# EAGLE design breadboarddev2 (EAGLE 8.4.3)
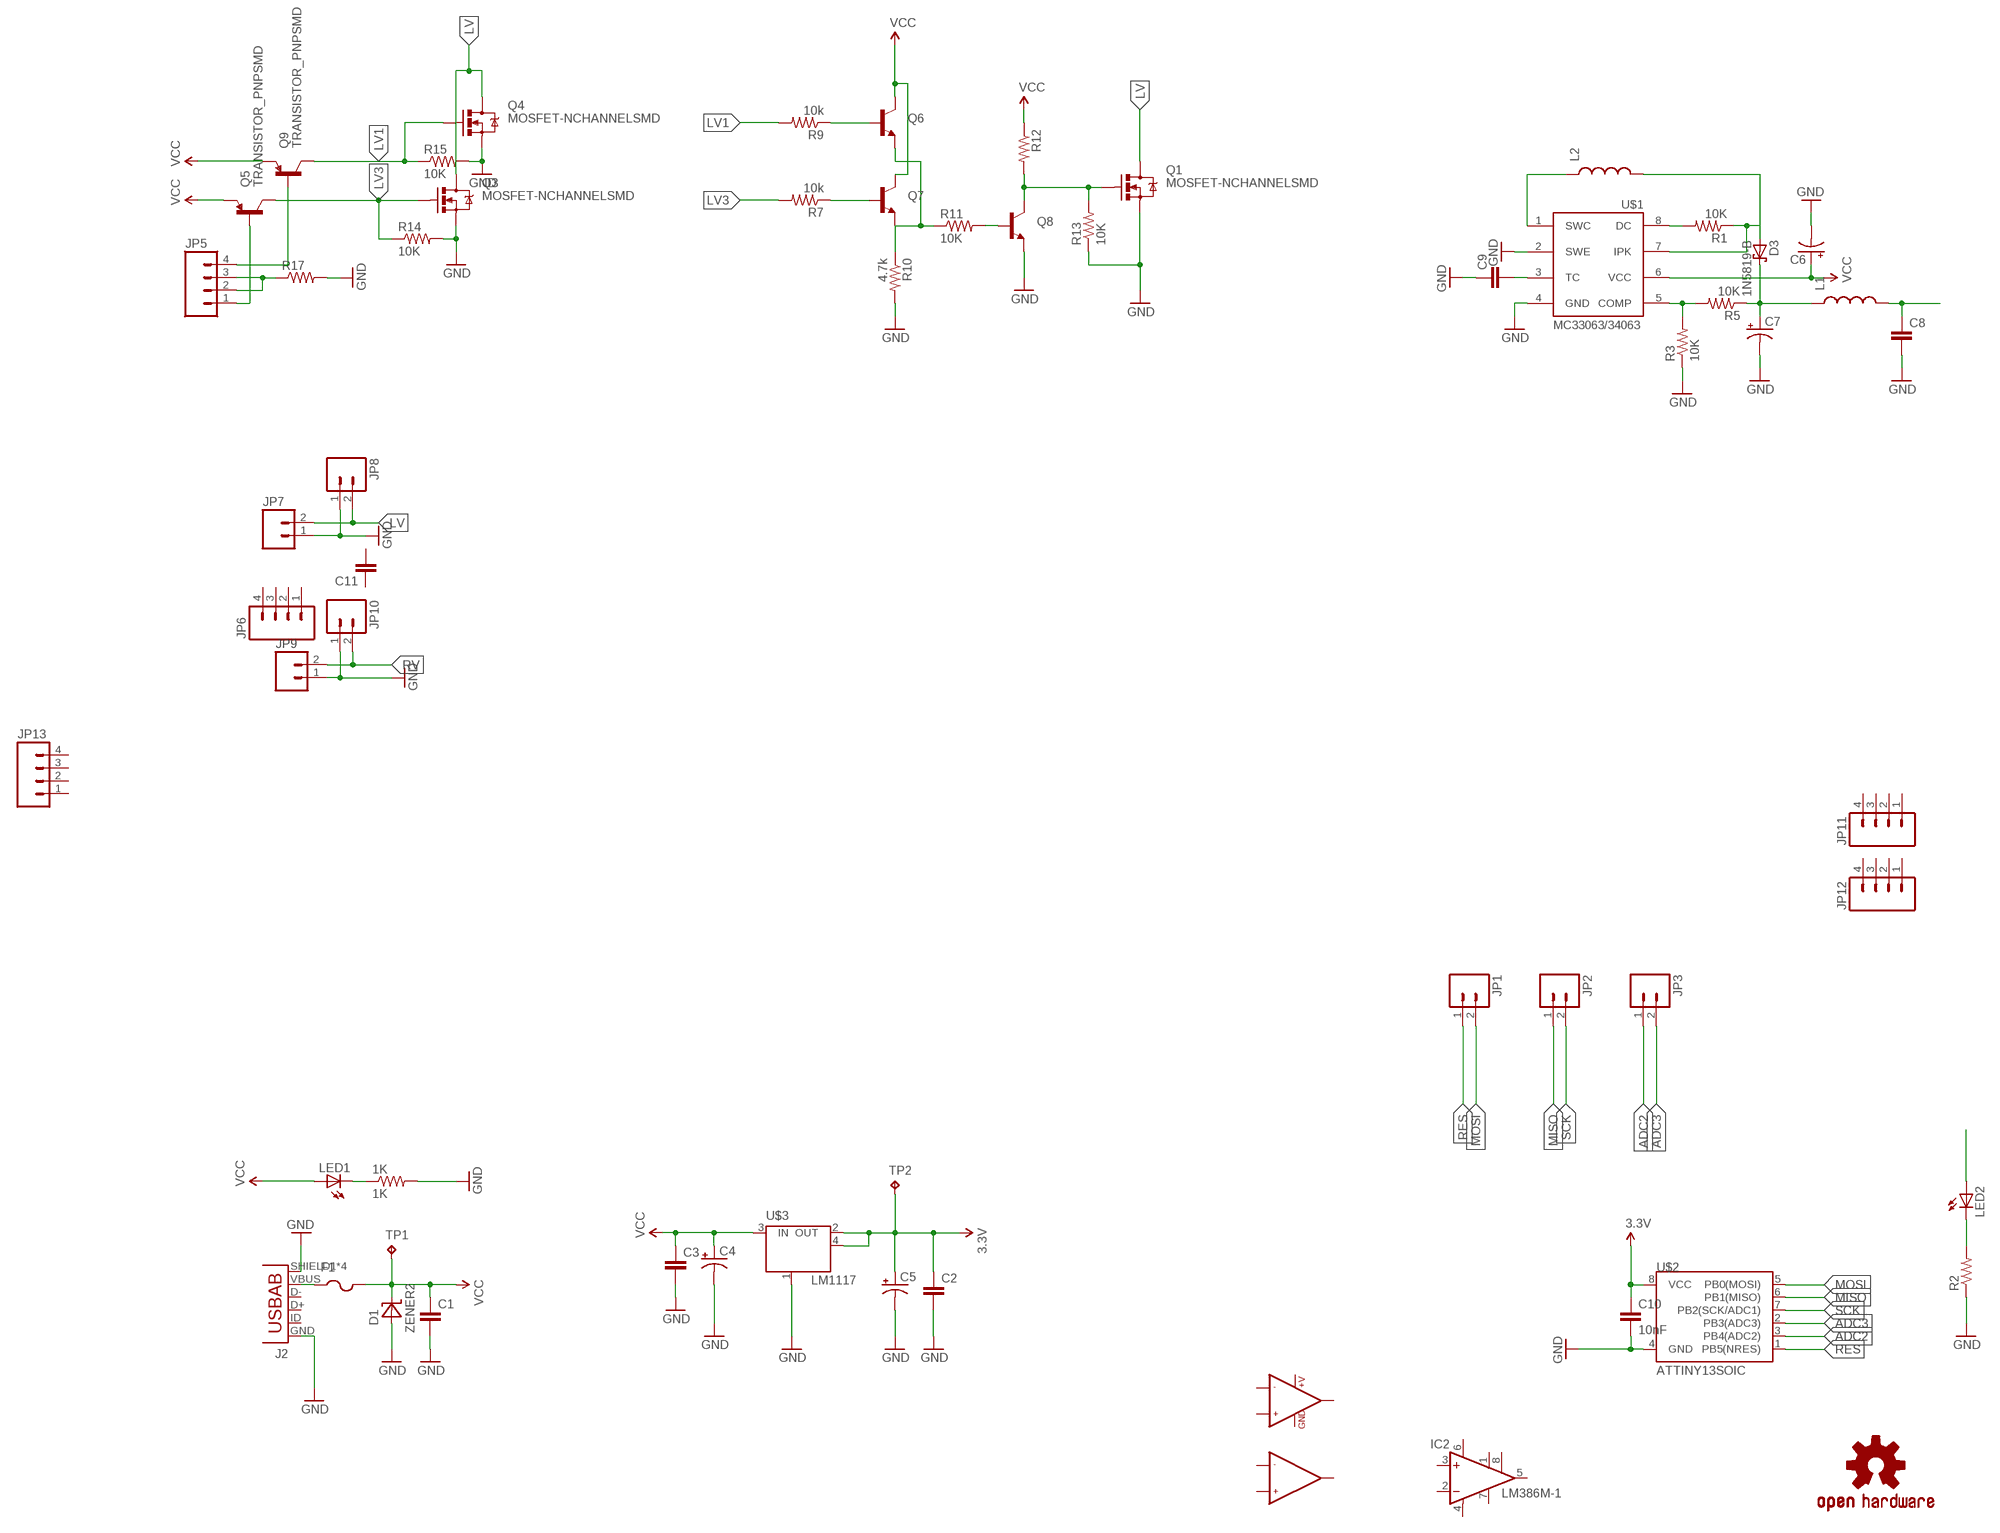
[diagram p0: schematic, sheet 1, part 1 of 2]
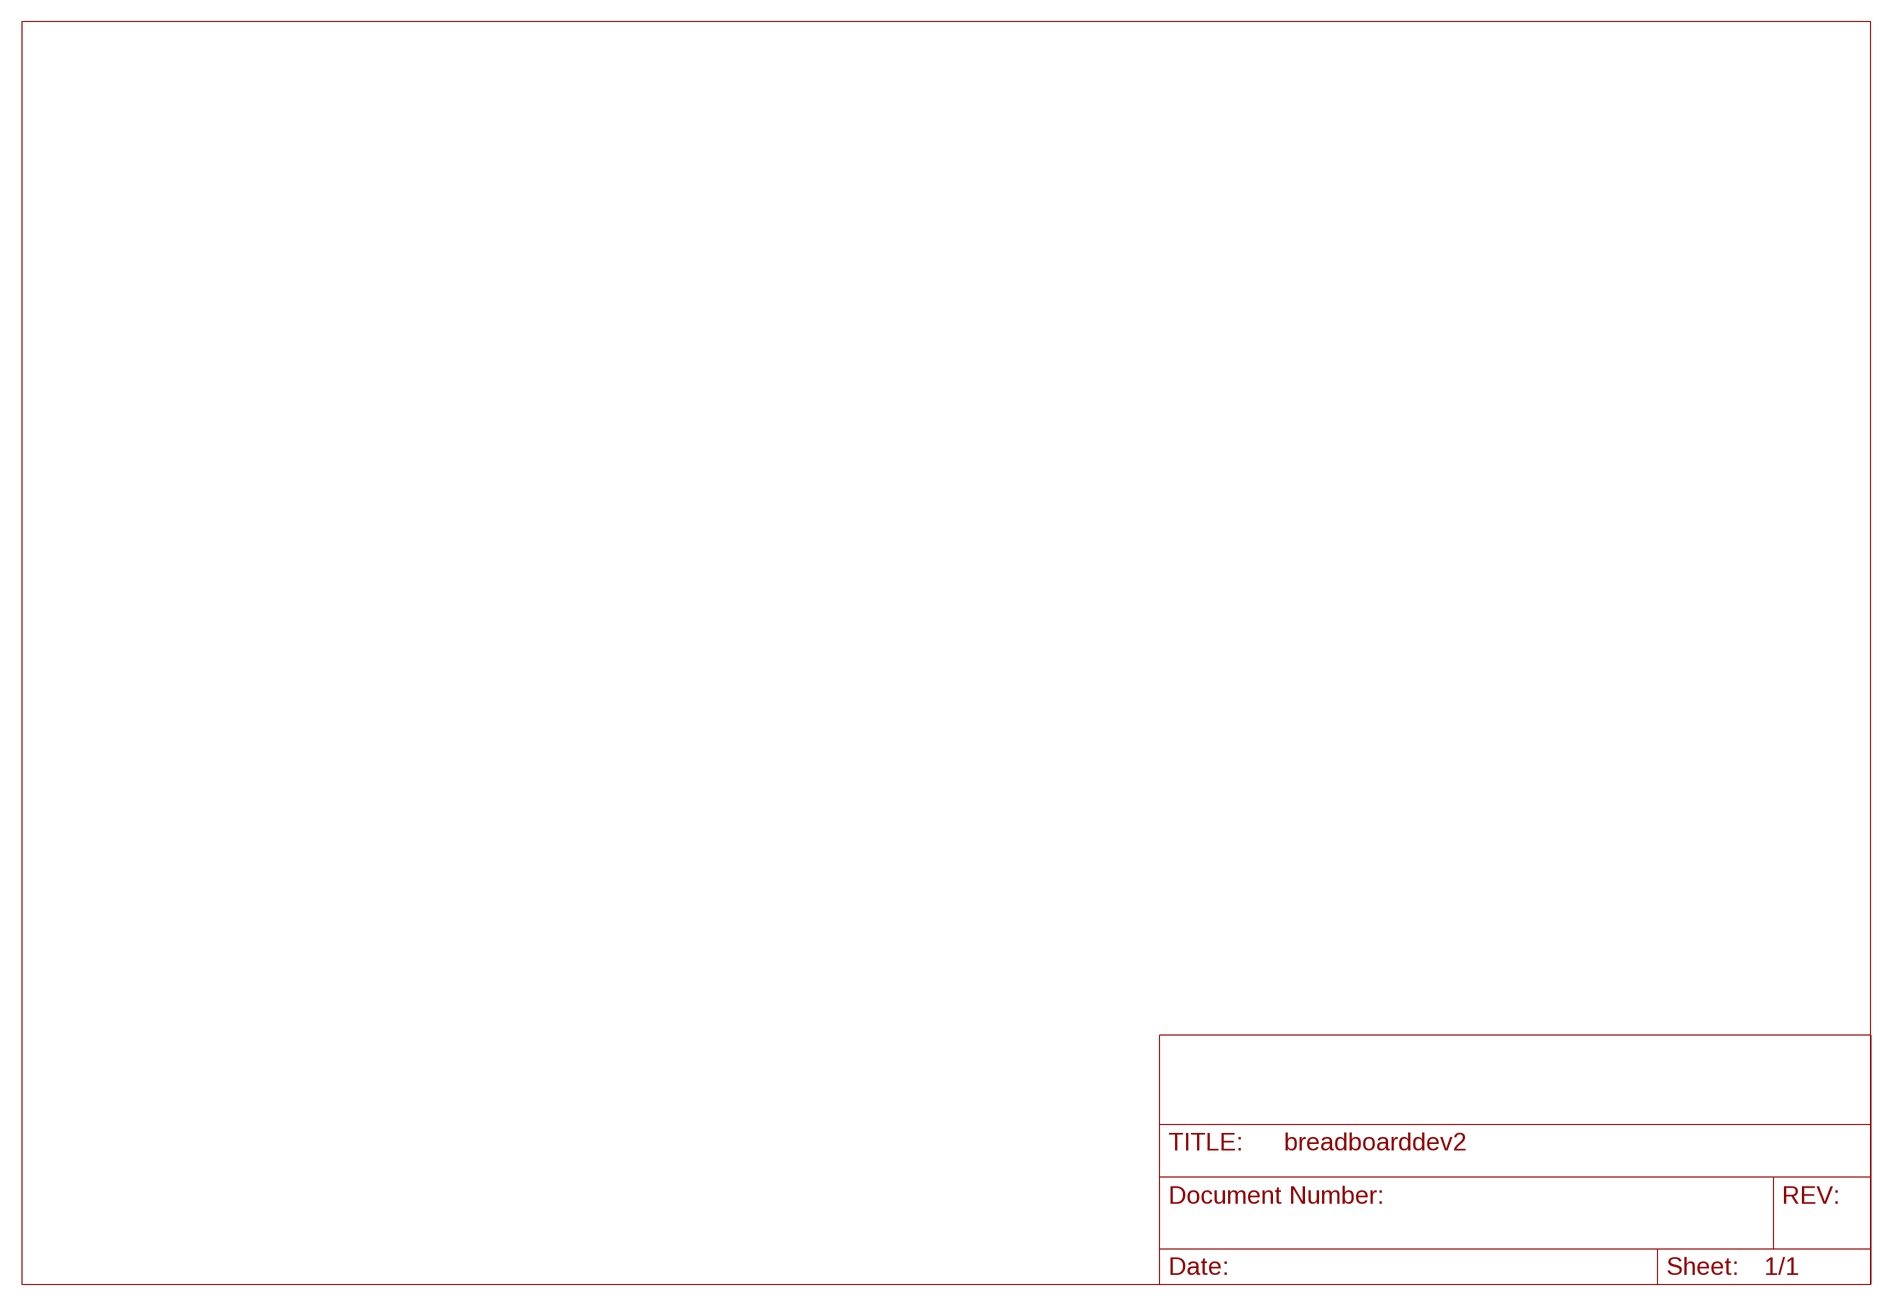
[diagram p1: schematic, sheet 1, part 2 of 2]

## Parts
1K  1K  R-US_R0603  [R0603]
C1  C-EUC0603K  [C0603K]
C2  C-EUC0603K  [C0603K]
C3  C-EUC0603K  [C0603K]
C4  CPOL-US153CLV-0405  [153CLV-0405]
C5  CPOL-US153CLV-0405  [153CLV-0405]
C6  CPOL-US153CLV-0405  [153CLV-0405]
C7  CPOL-US153CLV-0405  [153CLV-0405]
C8  CAP1206  [1206]
C9  C-EUC0603K  [C0603K]
C10  10nF  C-EUC0603K  [C0603K]
C11  C-EUC0603K  [C0603K]
D1  ZENER2  [SOD123]
D3  1N5819-B  [DO41-7.6]
F1  PTCFUSE-1206  [R1206]
IC2  LM386M-1  [SO08]
J2  USB-AB  [USB-AB-MICRO-SMD]
JP1  M021X02_NO_SILK  [1X02_NO_SILK]
JP2  M021X02_NO_SILK  [1X02_NO_SILK]
JP3  M021X02_NO_SILK  [1X02_NO_SILK]
JP5  M04PTH  [1X04]
JP6  M04PTH  [1X04]
JP7  M021X02_NO_SILK  [1X02_NO_SILK]
JP8  M021X02_NO_SILK  [1X02_NO_SILK]
JP9  M021X02_NO_SILK  [1X02_NO_SILK]
JP10  M021X02_NO_SILK  [1X02_NO_SILK]
JP11  M04PTH  [1X04]
JP12  M04PTH  [1X04]
JP13  M04PTH  [1X04]
L1  INDUCTOR0603  [0603]
L2  INDUCTOR.  [CDRH2D09]
LED1  LEDCHIP-LED0603  [CHIP-LED0603]
LED2  LED0603  [LED-0603]
Q1  MOSFET-NCHANNELSMD  [SOT23-3]
Q3  MOSFET-NCHANNELSMD  [SOT23-3]
Q4  MOSFET-NCHANNELSMD  [SOT23-3]
Q5  TRANSISTOR_PNPSMD  [SOT23-3]
Q6  TRANSISTOR_NPNSOT23  [SOT23]
Q7  TRANSISTOR_NPNSOT23  [SOT23]
Q8  TRANSISTOR_NPNSOT23  [SOT23]
Q9  TRANSISTOR_PNPSMD  [SOT23-3]
R1  10K  R-US_R0603  [R0603]
R2  R-US_R0603  [R0603]
R3  10K  R-US_R0603  [R0603]
R5  10K  R-US_R0603  [R0603]
R7  10k  R-US_R0603  [R0603]
R9  10k  R-US_R0603  [R0603]
R10  4.7k  R-US_R0603  [R0603]
R11  10K  R-US_R0603  [R0603]
R12  R-US_R0603  [R0603]
R13  10K  R-US_R0603  [R0603]
R14  10K  R-US_R0603  [R0603]
R15  10K  R-US_R0603  [R0603]
R17  R-US_R0603  [R0603]
TP1  TPB1,27  [B1,27]
TP2  TPB1,27  [B1,27]
U$1  MC33063/MC34063D  [SO08]
U$2  ATTINY13SOIC  [SO08]
U$3  LM1117  [SOT223]
U$4  LMV358  [SO08]
U$5  OSHW-LOGOS  [OSHW-LOGO-S]

## Nets
3.3V: C2.1 C5.+ C10.1 TP2.TP U$2.8(VCC) U$3.2(OUT) U$3.4(OUT)
ADC2: JP3.1 U$2.3(PB4(ADC2))
ADC3: JP3.2 U$2.2(PB3(ADC3))
GND: 1K.2 C1.2 C2.2 C3.2 C4.- C5.- C6.- C7.- C8.2 C9.1 C10.2 D1.A J2.GND J2.SHIELD1(SHIELD) J2.SHIELD2(SHIELD) J2.SHIELD3(SHIELD) J2.SHIELD4(SHIELD) JP7.1 JP8.1 JP9.1 JP10.1 Q1.2(S) Q3.2(S) Q4.2(S) Q8.2(E) R2.1 R3.1 R10.2 R13.1 R14.2 R15.2 R17.2 U$1.2(SWE) U$1.4(GND) U$2.4(GND) U$3.1(GND/ADJ)
LV: JP7.2 JP8.2 Q1.3(D) Q3.3(D) Q4.3(D)
LV1: Q4.1(G) Q9.3(C) R9.2 R15.1
LV3: Q3.1(G) Q5.3(C) R7.2 R14.1
MISO: JP2.1 U$2.6(PB1(MISO))
MOSI: JP1.2 U$2.5(PB0(MOSI))
N$1: LED2.C R2.2
N$2: JP5.1 Q5.1(B)
N$3: F1.1 J2.VBUS
N$4: C8.1 L1.2
N$5: LED2.A
N$6: C7.+ D3.C L1.1 R5.1
N$7: R3.2 R5.2 U$1.5(COMP)
N$8: L2.P$1 U$1.1(SWC)
N$9: JP5.4 Q9.1(B)
N$10: Q6.1(B) R9.1
N$11: Q7.1(B) R7.1
N$12: R1.2 U$1.8(DC)
N$13: 1K.1 LED1.C
N$15: Q6.2(E) Q7.2(E) R10.1 R11.1
N$16: D3.A L2.P$2 R1.1 U$1.7(IPK)
N$17: Q8.1(B) R11.2
N$18: Q1.1(G) Q8.3(C) R12.2 R13.2
N$19: C9.2 U$1.3(TC)
N$28: JP5.2 JP5.3 R17.1
RES: JP1.1 U$2.1(PB5(NRES))
RV: JP9.2 JP10.2
SCK: JP2.2 U$2.7(PB2(SCK/ADC1))
VCC: C1.1 C3.1 C4.+ C6.+ D1.C F1.2 LED1.A Q5.2(E) Q6.3(C) Q7.3(C) Q9.2(E) R12.1 TP1.TP U$1.6(VCC) U$3.3(IN)
Unconnected: C11.1 C11.2 IC2.1(GAIN) IC2.2(-IN) IC2.3(+IN) IC2.5(OUT) IC2.7(BYPASS) IC2.8(GAIN) J2.D+ J2.D- J2.ID(USBID) JP6.1 JP6.2 JP6.3 JP6.4 JP11.1 JP11.2 JP11.3 JP11.4 JP12.1 JP12.2 JP12.3 JP12.4 JP13.1 JP13.2 JP13.3 JP13.4 U$4.1(OUT1) U$4.2(-IN1) U$4.3(+IN1) U$4.5(+IN2) U$4.6(-IN2) U$4.7(OUT2)

## Power pins joined to a net without a drawn wire
+V: U$4.8(+V)
GND: IC2.4(GND) U$4.4(GND)
VS: IC2.6(VS)

## Library data of the parts
1K R1-R3 R5 R7 R9-R15 R17 = adafruit:R-US_: RESISTOR, American symbol
C1-C3 C9-C11 = rcl:C-EU: CAPACITOR, European symbol
C4-C7 = adafruit:CPOL-US: POLARIZED CAPACITOR, American symbol
C8 = SparkFun:CAP: Capacitor Standard 0603 ceramic capacitor, and 0.1" leaded capacitor.
D1 = smt_diodes:ZENER
D3 = diode:1N581*: 1.0A SCHOTTKY BARRIER RECTIFIER Source: http://www.diodes.com/datasheets/ds23001.pdf
F1 = adafruit:PTCFUSE: PTC fuses, resettable thermistors
IC2 = linear:LM386?-*: Low Voltage Audio Power Amplifier Source: http://cache.national.com/ds/LM/LM386.pdf
J2 = SparkFun-Connectors:USB-AB: This is a USB AB connector that is compatible with USB OTG. i.e. this connector can serve as a host or device
JP1-JP3 JP7-JP10 = SparkFun:M02: Header 2 Standard 2-pin 0.1" header. Use with straight break away headers (SKU : PRT-00116), right angle break away headers (PRT-00553), swiss pins (PRT-00743), machine pins (PRT-00117), and female headers (PRT-00115). Molex polarized connector foot print use with SKU : PRT-08233 with associated crimp pins and housings.
JP5 JP6 JP11-JP13 = SparkFun:M04: Header 4 Standard 4-pin 0.1" header. Use with straight break away headers (SKU : PRT-00116), right angle break away headers (PRT-00553), swiss pins (PRT-00743), machine pins (PRT-00117), and female headers (PRT-00115). Molex polarized connector foot print use with SKU : PRT-08231 with associated crimp pins and housings. 1MM SMD Version SKU: PRT-10208
L1 L2 = SparkFun:INDUCTOR: Inductors Basic Inductor/Choke - 0603 and 1206. Footprints are not proven and vary greatly between part numbers.
LED1 = adafruit:LED: LED OSRAM: - CHIPLED LG R971, LG N971, LY N971, LG Q971, LY Q971, LO R971, LY R971 LH N974, LH R974 LS Q976, LO Q976, LY Q976 LO Q996 - Hyper CHIPLED LW Q18S LB Q993, LB Q99A, LB R99A - SideLED LS A670, LO A670, LY A670, LG A670, LP A670 LB A673, LV A673, LT A673, LW A673 LH A674 LY A675 LS A676, LA A676, LO A676, LY A676, LW A676 LS A679, LY A679, LG A679 - Hyper Micro SIDELED® LS Y876, LA Y876, LO Y876, LY Y876 LT Y87S - SmartLED LW L88C, LW L88S LB L89C, LB L89S, LG L890 LS L89K, LO L89K, LY L89K LS L896, LA L896, LO L896, LY L896 - TOPLED LS T670, LO T670, LY T670, LG T670, LP T670 LSG T670, LSP T670, LSY T670, LOP T670, LYG T670 LG T671, LOG T671, LSG T671 LB T673, LV T673, LT T673, LW T673 LH T674 LS T676, LA T676, LO T676, LY T676, LB T676, LH T676, LSB T676, LW T676 LB T67C, LV T67C, LT T67C, LS T67K, LO T67K, LY T67K, LW E67C LS E67B, LA E67B, LO E67B, LY E67B, LB E67C, LV E67C, LT E67C LW T67C LS T679, LY T679, LG T679 LS T770, LO T770, LY T770, LG T770, LP T770 LB T773, LV T773, LT T773, LW T773 LH T774 LS E675, LA E675, LY E675, LS T675 LS T776, LA T776, LO T776, LY T776, LB T776 LHGB T686 LT T68C, LB T68C - Hyper Mini TOPLED® LB M676 - Mini TOPLED Santana® LG M470 LS M47K, LO M47K, LY M47K Source: http://www.osram.convergy.de/
LED2 = SparkFun:LED: LEDs Standard schematic elements and footprints for 5mm, 3mm, 1206, and 0603 sized LEDs. 5mm - Spark Fun Electronics SKU : COM-00529 (and others)
Q1 Q3 Q4 = SparkFun:MOSFET-NCHANNEL
Q5 Q9 = SparkFun:TRANSISTOR_PNP
Q6-Q8 = SparkFun:TRANSISTOR_NPN: Transistor NPN BJT configuration in SOT23 package. MMBT2222 is the common NPN we use. Double check BCE configuration again layout.
TP1 TP2 = testpad:TP: Test pad
U$1 = adafruit:MC33063/MC34063: MC33063 and MC34063 Basic DC/DC converter with internal power-NPN transistor, 100KHz, 1.5A peak switch current. 3-40 input/output.
U$2 = SparkFun:ATTINY13
U$3 = voltage_regulators:LM1117
U$4 = SparkFun:LMV358
U$5 = SparkFun:OSHW-LOGO: Open Source Hardware Logo This logo indicates the piece of hardware it is found on incorporates a OSHW license and/or adheres to the definition of open source hardware found here: http://freedomdefined.org/OSHW

## Board
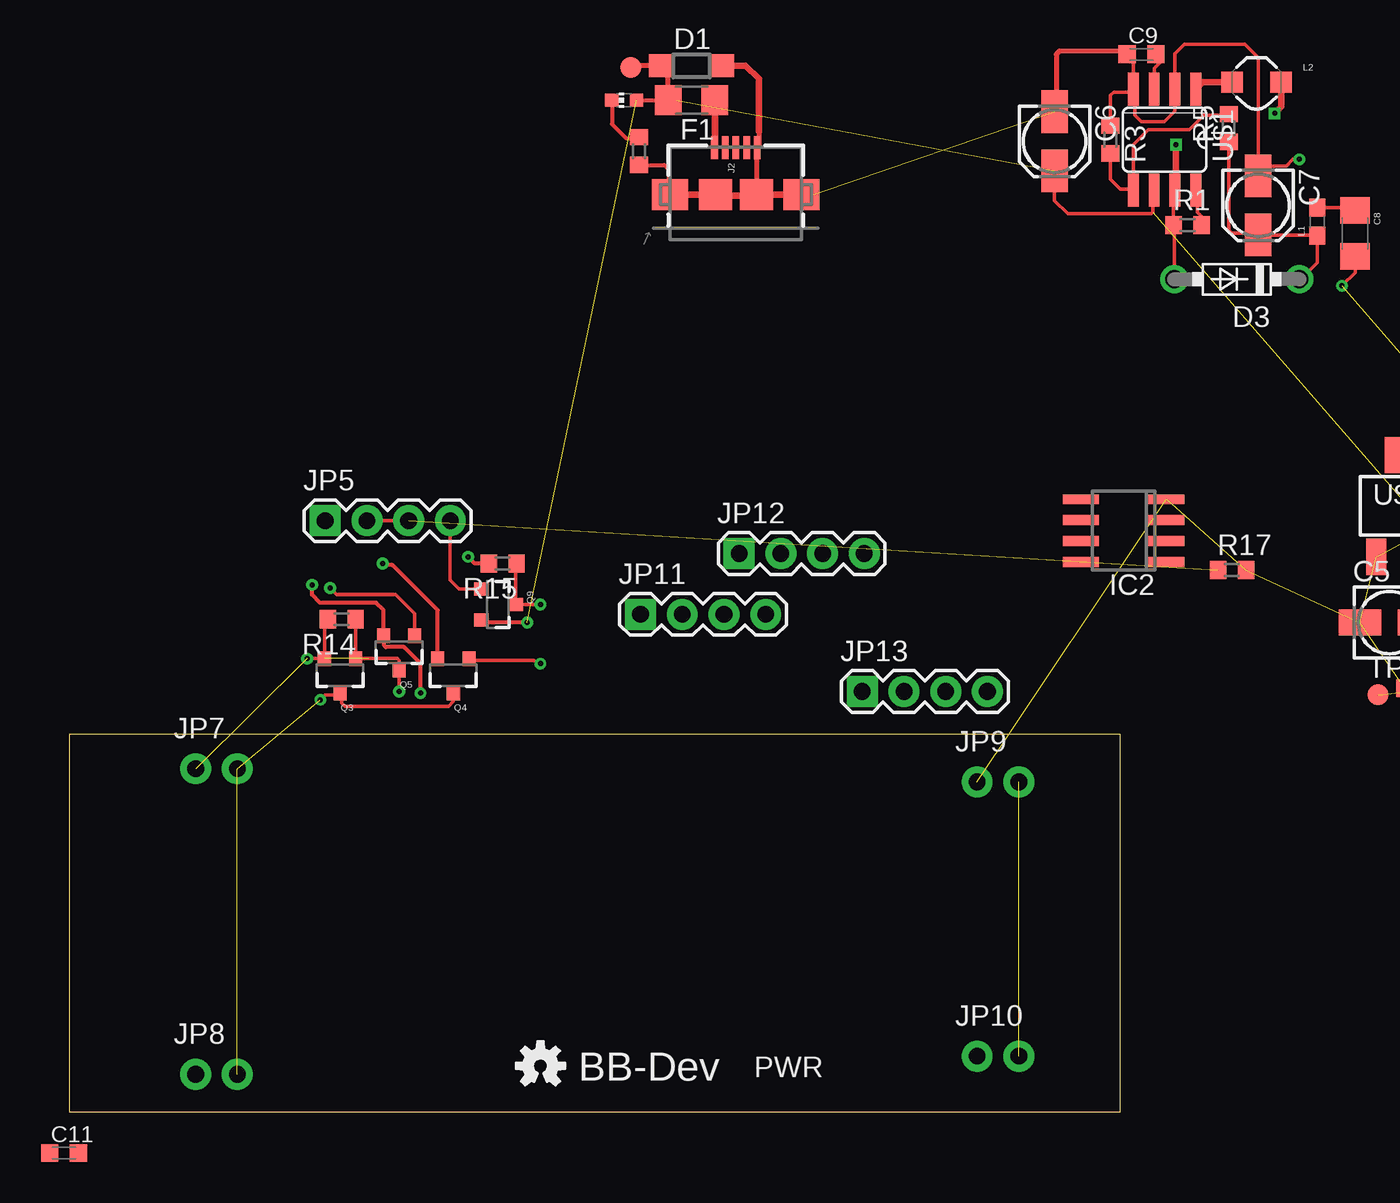
[diagram p2: board, top side]
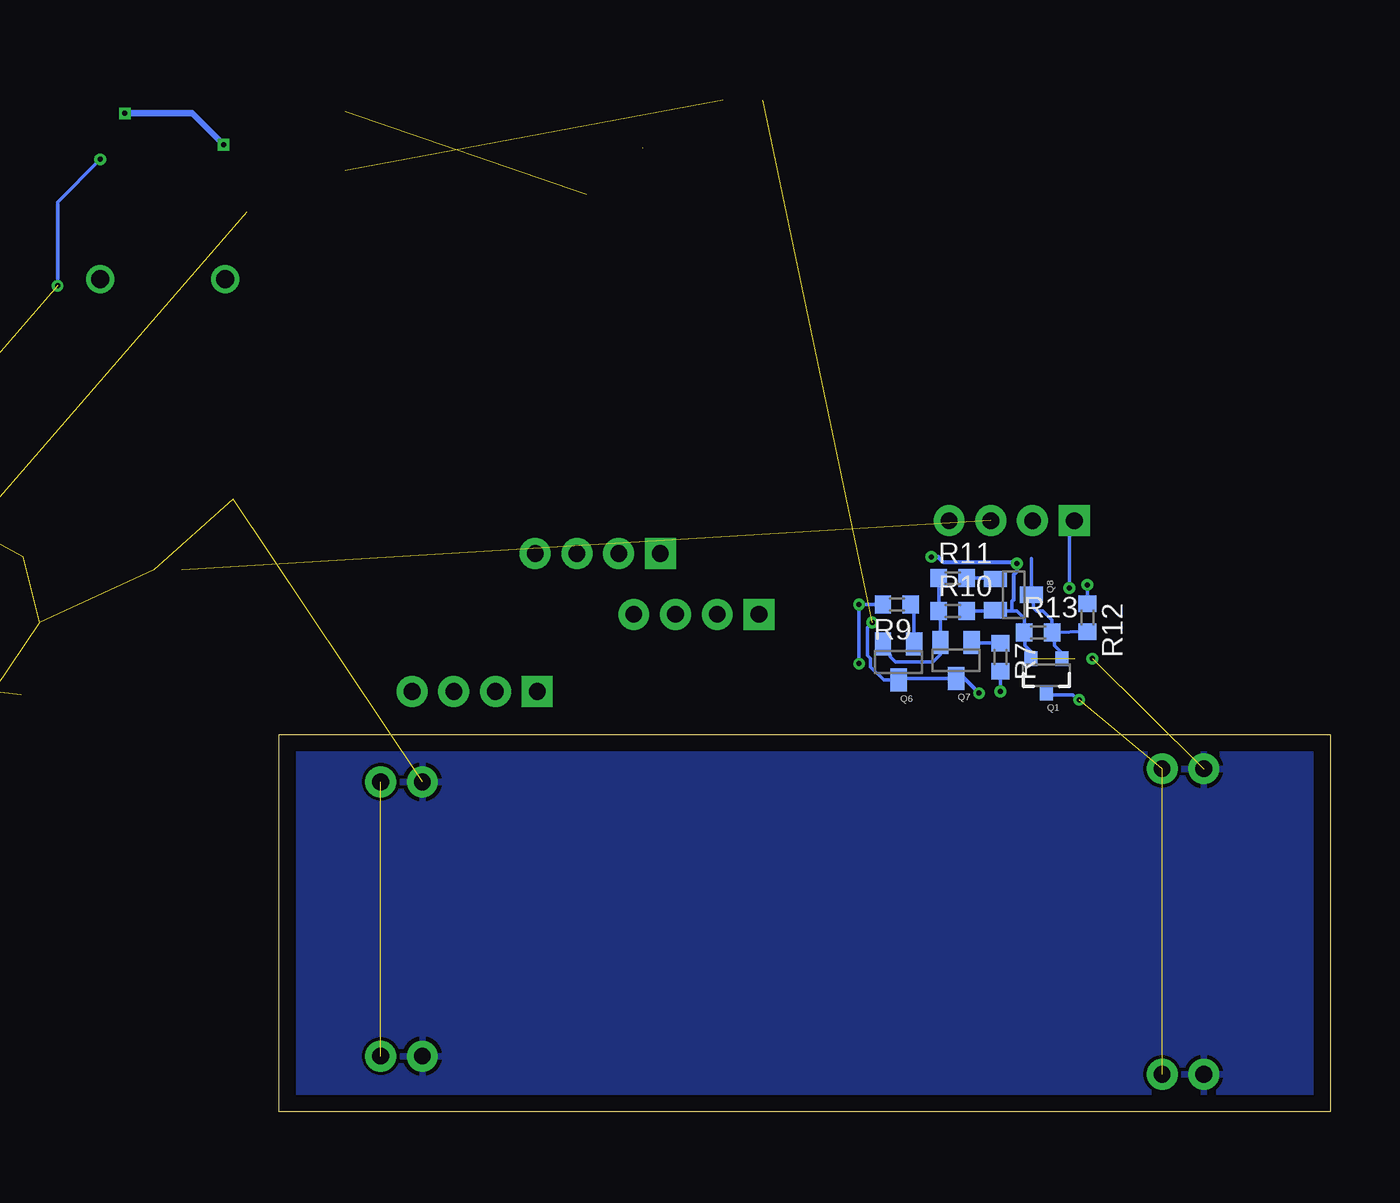
[diagram p3: board, bottom side, seen from below]

Size 64 x 23 mm. Coordinates in mm from the lower left corner, seen from the top.
Outline: 0,23 0,0 64,0 64,23 0,23
Copper layers (1*16): Top 0.035mm / dielectric 1.5mm / Bottom 0.035mm
Design rules "default": minimum track width 10mil, minimum drill 24mil, track to track 8mil, track to pad 8mil, pad to pad 8mil, via to via 8mil, smd to smd 8mil, copper to edge 40mil, drill to drill 8mil, minimum pad ring 10mil, minimum via ring 8mil, stop-mask expansion 4mil, vias tented up to drill 0mil, thermal gap 10mil

### Footprints (pad centres in the part's own frame; a part is rotated, then mirrored left to right if it is on the bottom)
R0603 = smd 1 x 1.1: 1 -0.85,0; 2 0.85,0
C0603K = smd 1.05 x 1.08: 1 -0.875,0; 2 0.875,0
153CLV-0405 = smd 2.6 x 1.6: + 1.8,0; - -1.8,0
1206 = smd 1.6 x 1.8: 1 -1.4,0; 2 1.4,0
SOD123 = smd 1.4 x 1.4: A 1.9,0; C -1.9,0
DO41-7.6 = drill 1.1 pad 1.7: A 3.81,0; C -3.81,0
R1206 = smd 1.6 x 1.803: 1 -1.422,0; 2 1.422,0
SO08 = smd 0.6 x 2.2: 1 -1.905,-2.6; 2 -0.635,-2.6; 3 0.635,-2.6; 4 1.905,-2.6; 5 1.905,2.6; 6 0.635,2.6; 7 -0.635,2.6; 8 -1.905,2.6
USB-AB-MICRO-SMD = smd 1.4 x 0.4: D+ 2.85,0; D- 2.85,0.65; GND 2.85,-1.3; ID 2.85,-0.65; VBUS 2.85,1.3 | smd 1.9 x 2.2: SHIELD1 0,4; SHIELD4 0,-4 | smd 1.9 x 2: SHIELD2 0,1.25; SHIELD3 0,-1.25
1X02_NO_SILK = drill 1.016 pad 1.88: 1 0,0; 2 2.54,0
1X04 = drill 1.016 pad 1.88 square: 1 0,0 | drill 1.016 pad 1.88: 2 2.54,0; 3 5.08,0; 4 7.62,0
0603 = smd 1.1 x 1: 1 -0.85,0; 2 0.85,0
CDRH2D09 = smd 1.3 x 1.3: P$1 -1.5,0; P$2 1.5,0
CHIP-LED0603 = smd 0.8 x 0.8: A 0,-0.75; C 0,0.75
LED-0603 = smd 0.8 x 0.8: A 0,-0.75; C 0,0.75
SOT23-3 = smd 0.8 x 0.9: 1 -0.95,-1; 2 0.95,-1; 3 0,1.1
SOT23 = smd 1 x 1.4: 1 -0.95,-1.1; 2 0.95,-1.1; 3 0,1.1
B1,27 = smd 1.27 x 1.27: TP 0,0
SO08' = smd 0.66 x 2.032: 1 -1.905,-3.073; 2 -0.635,-3.073; 3 0.635,-3.073; 4 1.905,-3.073; 5 1.905,3.073; 6 0.635,3.073; 7 -0.635,3.073; 8 -1.905,3.073
SO08'' = smd 0.61 x 2.21: 1 -1.905,-2.616; 2 -0.635,-2.616; 3 0.635,-2.616; 4 1.905,-2.616; 5 1.905,2.616; 6 0.635,2.616; 7 -0.635,2.616; 8 -1.905,2.616
SOT223 = smd 1.219 x 2.235: 1 -2.311,-3.099; 2 0,-3.099; 3 2.311,-3.099 | smd 3.6 x 2.2: 4 0,3.099

### Placement (x,y rotation side)
1K  34.7,58.5 270 top  (outside the outline)
C1  91.36,15.83 270 top  (outside the outline)
C2  82.2,25.8 180 top  (outside the outline)
C3  87,22.3 270 bottom  (outside the outline)
C4  87.9,36.5 270 top  (outside the outline)
C5  80.4,29.8 0 top  (outside the outline)
C6  60,59.1 270 top  (outside the outline)
C7  72.4,55.2 270 top  (outside the outline)
C8  78.3,53.5 270 top  (outside the outline)
C9  65.3,64.4 0 top  (outside the outline)
C10  95.4,25.5 90 bottom  (outside the outline)
C11  -0.3,-2.5 0 top
D1  37.9,63.7 0 top  (outside the outline)
D3  71.1,50.7 180 top  (outside the outline)
F1  37.9,61.6 180 top  (outside the outline)
IC2  64.2,35.4 90 top  (outside the outline)
J2  40.6,55.85 90 top  (outside the outline)
JP1  87,45.9 90 top  (outside the outline)
JP2  89.5,45.9 90 top  (outside the outline)
JP3  92,48.5 270 top  (outside the outline)
JP5  15.6,36 0 top  (outside the outline)
JP6  93.3,3.9 90 top  (outside the outline)
JP7  7.71,20.9 0 top
JP8  7.71,2.3 0 top
JP9  55.29,20.1 0 top
JP10  55.29,3.4 0 top
JP11  34.8,30.3 0 top  (outside the outline)
JP12  40.8,34 0 top  (outside the outline)
JP13  48.3,25.6 0 top
L1  76,54.2 90 top  (outside the outline)
L2  72.3,62.7 0 top  (outside the outline)
LED1  33.8,61.6 90 top  (outside the outline)
LED2  97.7,5.8 0 top  (outside the outline)
Q1  17.3,26.6 180 bottom
Q3  16.5,26.6 180 top
Q4  23.4,26.6 180 top
Q5  20.1,28 180 top  (outside the outline)
Q6  26.3,27.4 180 bottom  (outside the outline)
Q7  22.8,27.5 180 bottom  (outside the outline)
Q8  19.3,31.5 270 bottom  (outside the outline)
Q9  26.1,30.9 270 top  (outside the outline)
R1  68.1,54 0 top  (outside the outline)
R2  97.7,8.7 270 top  (outside the outline)
R3  63.4,59.2 270 top  (outside the outline)
R5  70.6,59.9 90 top  (outside the outline)
R7  20.1,27.7 270 bottom  (outside the outline)
R9  26.4,30.9 180 bottom  (outside the outline)
R10  23,30.5 0 bottom  (outside the outline)
R11  23,32.5 0 bottom  (outside the outline)
R12  14.8,30.1 270 bottom  (outside the outline)
R13  17.8,29.2 0 bottom  (outside the outline)
R14  16.6,30 180 top  (outside the outline)
R15  26.4,33.4 180 top  (outside the outline)
R17  70.8,33 0 top  (outside the outline)
TP1  34.2,63.6 0 top  (outside the outline)
TP2  79.7,25.4 0 top  (outside the outline)
U$1  MC33063/MC34063D  [SO08']  66.7,59.2 180 top  (outside the outline)
U$2  ATTINY13SOIC  [SO08'']  92.3,25.5 180 bottom  (outside the outline)
U$3  81.9,36.9 0 top  (outside the outline)
U$4  LMV358  [SO08'']  86.6,13 90 top  (outside the outline)
U$5  28.7,2.8 0 top

### Tracks (layer width: path | path; a pad name or v marks a point on that pad's centre or on a via)
3.3V  (6 unrouted)
ADC2  (1 unrouted)
ADC3  (1 unrouted)
GND  (via drill 0.3)  (17 unrouted)
  Top 0.2: R14.2 15.55,29.8 Q3.2 v14.5,27.6
  Top 0.205: U$1.4 64.9,62.17 64.9,60.7 65.3,60.3 66.7,60.3 67.33,60.94 U$1.2 67.33,64.44 67.9,65 71.6,65 72.4,64.2 72.4,57.6 | U$1.4 64.8,64.63 C9.1 64.42,64.6 | R3.1 63.4,61.9 63.6,62.1 64.62,62.1 U$1.4 | 72.4,57.6 C7.- | C8.2 78.3,51.1 v77.5,50.3 | v74.9,58 74.5,58 74.1,57.6 72.4,57.6
  Top 0.254: 1K.2 36.25,57.65 36.5,57.4 36.5,55.95 J2.SHIELD1 | Q4.2 22.45,30.55 19.7,33.3 19.2,33.3 v19.1,33.4 | R15.2 24.7,33.4 v24.3,33.8
  Top 0.305: 42,59.7 42,58.8 J2.GND | 41.85,58.7 J2.SHIELD3 | 64.42,64.6 60.3,64.6 60.1,64.4 60.1,61 C6.-
  Top 0.406: J2.SHIELD1 J2.SHIELD2 39.35,55.8 41.8,55.8 41.8,55.85 J2.SHIELD3 J2.SHIELD4 | J2.SHIELD4 45.3,55.85 45.3,55.7 44.6,55.7 J2.SHIELD4 | D1.A 41.2,63.7 42,62.9 42,59.7
  Bottom 0.2: R10.2 20.45,30.5 Q8.2 20.35,30.5 19.4,30.5 | Q1.2 18.25,28.05 18.6,28.4 18.6,29.15 R13.1 18.65,30.05 19.1,30.5 19.4,30.5 | 19.4,30.5 19.4,31.1 19.3,31.2
  Bottom 0.205: v77.5,50.3 77.5,55.4 v74.9,58
  Bottom 0.254: 19.3,31.2 19.3,32.7 19.1,32.9 v19.1,33.4 19.2,33.5 23.6,33.5 23.9,33.8 v24.3,33.8
  pour Bottom: -1.6,23.5 -1.1,0 43.1,-0.2 72,-0.1 71.1,23.6
LV  (via drill 0.3)  (2 unrouted)
  Top 0.2: Q4.3 23.4,25 23.1,24.7 16.8,24.7 16.6,24.9 16.6,25.4 | 16.6,25.4 Q3.3 | 16.6,25.4 15.6,25.4 v15.3,25.1
  Bottom 0.2: v15.3,25.1 15.4,25.1 15.7,25.4 17.2,25.4 Q1.3
LV1  (via drill 0.3)
  Top 0.2: v28.7,30.9 Q9.3 27.2,33.35 R15.1 | 24.45,27.7 Q4.1 24.45,27.5 28.3,27.5 28.5,27.3 v28.7,27.3
  Bottom 0.2: R9.2 v28.7,30.9 v28.7,27.3
LV3  (via drill 0.3)
  Top 0.2: v20.1,25.6 Q5.3 20.1,27.5 20,27.6 Q3.1 R14.1
  Bottom 0.2: v20.1,25.6 R7.2
MISO  (1 unrouted)
MOSI  (1 unrouted)
N$1  (1 unrouted)
N$2  (via drill 0.3)
  Top 0.2: Q5.1 21.05,30.35 19.9,31.5 16.3,31.5 v15.9,31.9
  Bottom 0.2: v15.9,31.9 15.9,35 JP5.1
N$3
  Top 0.406: J2.VBUS 39.32,58.7 F1.1
N$4
  Top 0.205: L1.2 78.15,55.05 C8.1
N$6
  Top 0.205: D3.C 75,50.7 76,51.7 L1.1 75.95,53.4 C7.+ 72.3,53.5 70.8,53.5 70.6,53.7 R5.1
N$7
  Top 0.205: R3.2 63.4,56.8 64,56.2 64.72,56.2 U$1.5 64.8,58.9 65.7,59.8 68.2,59.8 69.1,60.7 70.55,60.7 R5.2
N$8
  Top 0.406: L2.P$1 69.03,62.7 U$1.1
N$9
  Top 0.2: Q9.1 23.75,31.85 23.2,32.4 23.2,35.28 JP5.4
N$10
  Bottom 0.2: Q6.1 25.35,30.8 R9.1
N$11
  Bottom 0.2: R7.1 21.85,28.55 Q7.1
N$12
  Top 0.205: R1.2 68.95,54.55 68.7,54.8 68.7,56.03 U$1.8
N$13
  Top 0.254: LED1.C 33.05,60.15 33.9,59.3 34.65,59.3 1K.1
N$15
  Bottom 0.2: Q6.2 26.8,27.75 26.8,27.7 26.5,27.4 24.2,27.4 23.75,27.85 Q7.2 23.75,30.4 R10.1 R11.1
N$16  (via drill 0.3)
  Top 0.205: D3.A 67.29,53.96 R1.1 67.25,56.04 U$1.7
  Top 0.406: L2.P$2 73.8,61.2 v73.4,60.8 | v67.4,58.9 67.4,56.19 U$1.7
  Bottom 0.406: v73.4,60.8 69.3,60.8 v67.4,58.9
N$17
  Bottom 0.2: R11.2 20.45,32.5 Q8.1
N$18
  Bottom 0.2: Q1.1 16.35,27.95 16.8,28.4 16.8,29.05 R13.2 | R13.2 16.95,29.95 17.5,30.5 17.9,30.5 18.1,30.7 18.1,31.4 Q8.3 18.2,33.7 | R12.2 R13.2
N$19
  Top 0.205: U$1.3 66.06,63.56 66.4,63.9 66.4,64.78 C9.2
N$28  (1 unrouted)
  Top 0.2: JP5.3 JP5.2
RES  (1 unrouted)
RV  (1 unrouted)
SCK  (1 unrouted)
VCC  (via drill 0.3)  (6 unrouted)
  Top 0.205: C6.+ 60,55.5 60.8,54.7 65.9,54.7 66,54.8 66,56.06 U$1.6
  Top 0.254: LED1.A F1.2 37,61.6 | v27.9,29.8 25.25,29.8 Q9.2 | v14.8,32.1 14.8,31.5 15.3,31 18.7,31 19.15,30.55 Q5.2 19.2,28.95 19.2,28.4 19.3,28.3 20.4,28.3 21.4,27.3 v21.4,25.5
  Top 0.305: TP1.TP 34.3,63.7 D1.C 36.48,63.22 F1.2
  Top 0.406: 36.2,61.88 F1.2
  Bottom 0.2: Q7.3 26.6,26.4 Q6.3 27.2,26.3 28,27.1 28,27.6 28.2,27.8 28.2,29.5 v27.9,29.8 28,29.6 | R12.1 v14.8,32.1
  Bottom 0.254: Q7.3 22.3,26.4 v21.4,25.5

### Text on the board
tPlace: BB-Dev | PWR
tValues: V 1.0